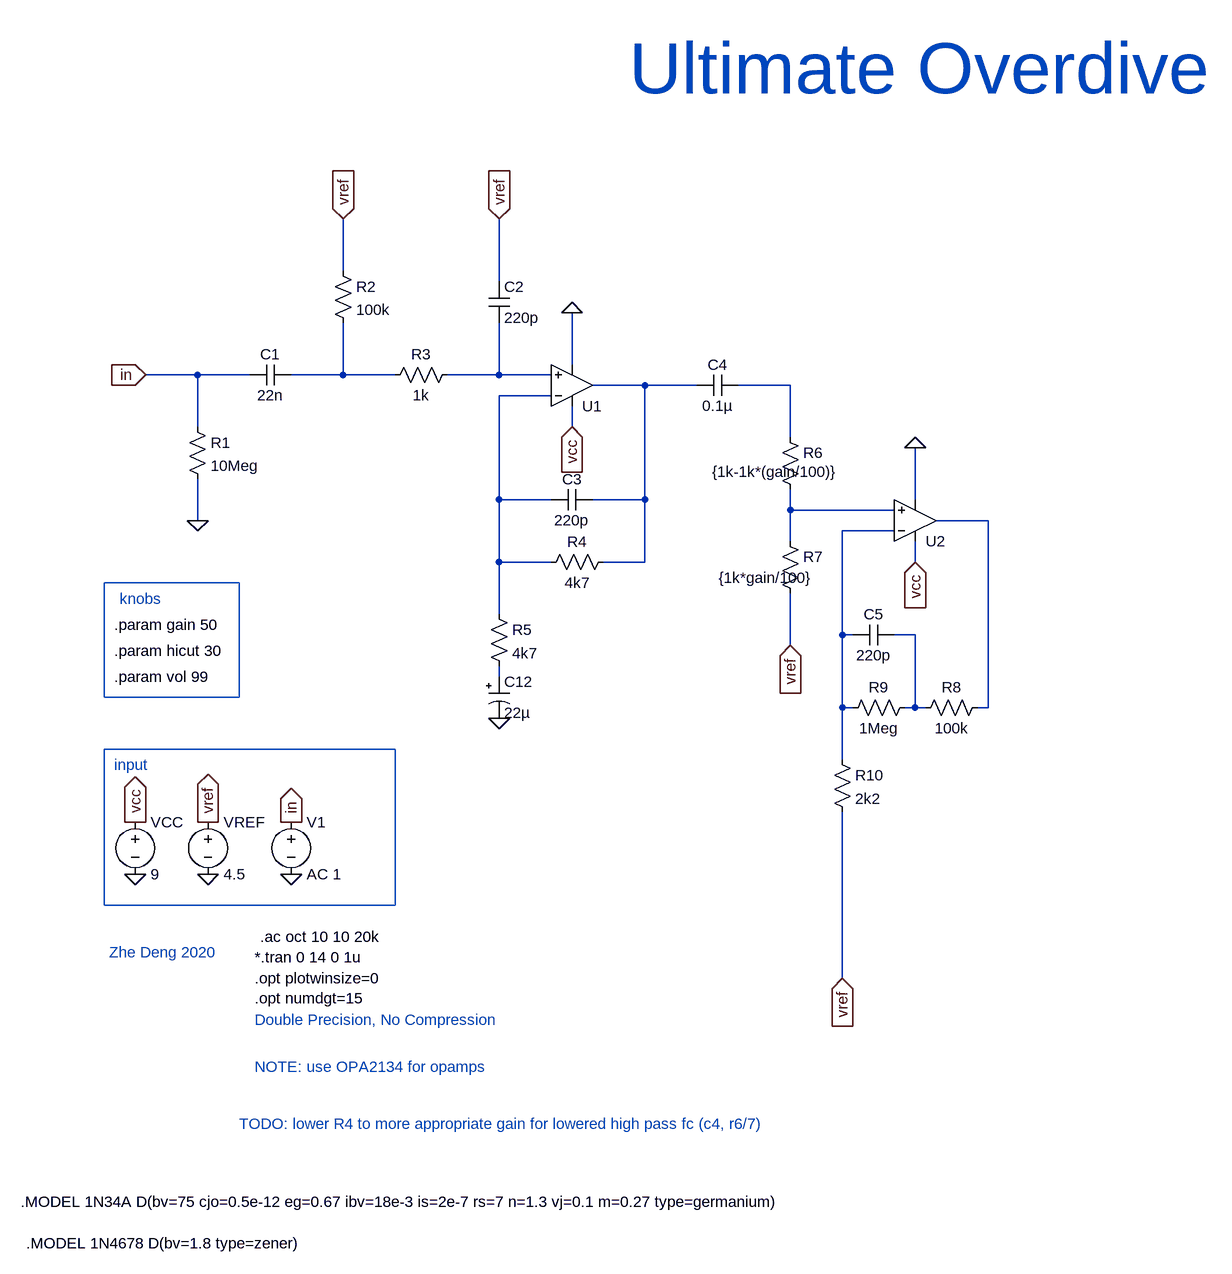
[diagram p0: schematic v2.asc]
v2.asc, the LTspice schematic file:
Version 4
SHEET 1 148324 120332
WIRE 145088 115648 145088 115568
WIRE 145328 115664 145328 115568
WIRE 145440 115792 145440 115712
WIRE 144864 115808 144784 115808
WIRE 144944 115808 144864 115808
WIRE 145088 115808 145088 115728
WIRE 145088 115808 145008 115808
WIRE 145168 115808 145088 115808
WIRE 145328 115808 145328 115728
WIRE 145328 115808 145248 115808
WIRE 145408 115808 145328 115808
WIRE 145552 115824 145472 115824
WIRE 145632 115824 145552 115824
WIRE 145776 115824 145696 115824
WIRE 145408 115840 145328 115840
WIRE 144864 115888 144864 115808
WIRE 145440 115888 145440 115856
WIRE 145776 115904 145776 115824
WIRE 145328 116000 145328 115840
WIRE 145408 116000 145328 116000
WIRE 145552 116000 145552 115824
WIRE 145552 116000 145472 116000
WIRE 145968 116000 145968 115920
WIRE 145776 116016 145776 115984
WIRE 145936 116016 145776 116016
WIRE 144864 116032 144864 115968
WIRE 146080 116032 146000 116032
WIRE 145936 116048 145856 116048
WIRE 145776 116064 145776 116016
WIRE 145328 116096 145328 116000
WIRE 145408 116096 145328 116096
WIRE 145552 116096 145552 116000
WIRE 145552 116096 145488 116096
WIRE 145968 116096 145968 116064
WIRE 145328 116176 145328 116096
WIRE 145856 116208 145856 116048
WIRE 145872 116208 145856 116208
WIRE 145968 116208 145936 116208
WIRE 145776 116224 145776 116144
WIRE 145328 116272 145328 116256
WIRE 145856 116320 145856 116208
WIRE 145872 116320 145856 116320
WIRE 145968 116320 145968 116208
WIRE 145968 116320 145952 116320
WIRE 145984 116320 145968 116320
WIRE 146080 116320 146080 116032
WIRE 146080 116320 146064 116320
WIRE 145856 116400 145856 116320
WIRE 145856 116736 145856 116480
FLAG 144768 116576 0
FLAG 144880 116576 0
FLAG 144880 116496 vref
IOPIN 144880 116496 Out
FLAG 144768 116496 vcc
IOPIN 144768 116496 Out
FLAG 145008 116496 in
IOPIN 145008 116496 Out
FLAG 145008 116576 0
FLAG 145088 115568 vref
IOPIN 145088 115568 In
FLAG 144784 115808 in
IOPIN 144784 115808 In
FLAG 145328 115568 vref
IOPIN 145328 115568 In
FLAG 145328 116336 0
FLAG 145968 115920 0
FLAG 145968 116096 vcc
IOPIN 145968 116096 In
FLAG 145440 115712 0
FLAG 145440 115888 vcc
IOPIN 145440 115888 In
FLAG 145856 116736 vref
IOPIN 145856 116736 In
FLAG 144864 116032 0
FLAG 145776 116224 vref
IOPIN 145776 116224 In
SYMBOL voltage 144768 116480 R0
WINDOW 123 0 0 Left 0
WINDOW 39 0 0 Left 0
SYMATTR InstName VCC
SYMATTR Value 9
SYMBOL voltage 144880 116480 R0
WINDOW 123 0 0 Left 0
WINDOW 39 0 0 Left 0
SYMATTR InstName VREF
SYMATTR Value 4.5
SYMBOL res 144848 115872 R0
SYMATTR InstName R1
SYMATTR Value 10Meg
SYMBOL cap 145008 115792 R90
WINDOW 0 0 32 VBottom 2
WINDOW 3 32 32 VTop 2
SYMATTR InstName C1
SYMATTR Value 22n
SYMBOL res 145072 115632 R0
SYMATTR InstName R2
SYMATTR Value 100k
SYMBOL res 145264 115792 R90
WINDOW 0 0 56 VBottom 2
WINDOW 3 32 56 VTop 2
SYMATTR InstName R3
SYMATTR Value 1k
SYMBOL cap 145312 115664 R0
SYMATTR InstName C2
SYMATTR Value 220p
SYMBOL cap 145472 115984 R90
WINDOW 0 0 32 VBottom 2
WINDOW 3 32 32 VTop 2
SYMATTR InstName C3
SYMATTR Value 220p
SYMBOL res 145504 116080 R90
WINDOW 0 0 56 VBottom 2
WINDOW 3 32 56 VTop 2
SYMATTR InstName R4
SYMATTR Value 4k7
SYMBOL res 145312 116160 R0
SYMATTR InstName R5
SYMATTR Value 4k7
SYMBOL cap 145696 115808 R90
WINDOW 0 0 32 VBottom 2
WINDOW 3 32 32 VTop 2
SYMATTR InstName C4
SYMATTR Value 0.1µ
SYMBOL res 145760 115888 R0
WINDOW 3 -104 69 Left 2
SYMATTR Value {1k-1k*(gain/100)}
SYMATTR InstName R6
SYMBOL res 145760 116048 R0
WINDOW 3 -94 72 Left 2
SYMATTR Value {1k*gain/100}
SYMATTR InstName R7
SYMBOL cap 145936 116192 R90
WINDOW 0 0 32 VBottom 2
WINDOW 3 32 32 VTop 2
SYMATTR InstName C5
SYMATTR Value 220p
SYMBOL res 146080 116304 R90
WINDOW 0 0 56 VBottom 2
WINDOW 3 32 56 VTop 2
SYMATTR InstName R8
SYMATTR Value 100k
SYMBOL res 145968 116304 R90
WINDOW 0 0 56 VBottom 2
WINDOW 3 32 56 VTop 2
SYMATTR InstName R9
SYMATTR Value 1Meg
SYMBOL res 145840 116384 R0
SYMATTR InstName R10
SYMATTR Value 2k2
SYMBOL polcap 145312 116272 R0
SYMATTR InstName C12
SYMATTR Value 22µ
SYMBOL Opamps\\UniversalOpamp2 145440 115824 M180
SYMATTR InstName U1
SYMBOL Opamps\\UniversalOpamp2 145968 116032 M180
SYMATTR InstName U2
SYMBOL voltage 145008 116480 R0
SYMATTR InstName V1
SYMATTR Value AC 1
TEXT 144736 116192 Left 2 !.param gain 50
TEXT 144736 116232 Left 2 !.param hicut 30
TEXT 144736 116272 Left 2 !.param vol 99
TEXT 144744 116152 Left 2 ;knobs
TEXT 144736 116408 Left 2 ;input
TEXT 144728 116696 Left 2 ;Zhe Deng 2020
TEXT 145528 115336 Left 7 ;Ultimate Overdive
TEXT 144952 116704 Left 2 !*.tran 0 14 0 1u
TEXT 144952 116736 Left 2 !.opt plotwinsize=0\n.opt numdgt=15
TEXT 144952 116800 Left 2 ;Double Precision, No Compression
TEXT 144960 116672 Left 2 !.ac oct 10 10 20k
TEXT 144952 116872 Left 2 ;NOTE: use OPA2134 for opamps
TEXT 144592 117080 Left 2 !.MODEL 1N34A D(bv=75 cjo=0.5e-12 eg=0.67 ibv=18e-3 is=2e-7 rs=7 n=1.3 vj=0.1 m=0.27 type=germanium)
TEXT 144600 117144 Left 2 !.MODEL 1N4678 D(bv=1.8 type=zener)
TEXT 144928 116960 Left 2 ;TODO: lower R4 to more appropriate gain for lowered high pass fc (c4, r6/7)
RECTANGLE Normal 144928 116304 144720 116128
RECTANGLE Normal 145168 116624 144720 116384

The netlist it stands for:
* v2.asc
VCC vcc 0 9
VREF vref 0 4.5
R1 in 0 10Meg
C1 N001 in 22n
R2 vref N001 100k
R3 N002 N001 1k
C2 vref N002 220p
C3 N003 N005 220p
R4 N003 N005 4k7
R5 N005 N010 4k7
C4 N004 N003 0.1µ
R6 N004 N006 {1k-1k*(gain/100)}
R7 N006 vref {1k*gain/100}
C5 N009 N008 220p
R8 N007 N009 100k
R9 N009 N008 1Meg
R10 N008 vref 2k2
C12 N010 0 22µ
XU1 N002 N005 vcc 0 N003 level.2 Avol=1Meg GBW=10Meg Slew=10Meg ilimit=25m rail=0 Vos=0 phimargin=45 en=0 enk=0 in=0 ink=0 Rin=500Meg  ; pins IN+ IN- V+ V- OUT
XU2 N006 N008 vcc 0 N007 level.2 Avol=1Meg GBW=10Meg Slew=10Meg ilimit=25m rail=0 Vos=0 phimargin=45 en=0 enk=0 in=0 ink=0 Rin=500Meg  ; pins IN+ IN- V+ V- OUT
V1 in 0 AC 1
.param gain 50
.param hicut 30
.param vol 99
* knobs
* input
* Zhe Deng 2020
* Ultimate Overdive
*.tran 0 14 0 1u
.opt plotwinsize=0
.opt numdgt=15
* Double Precision, No Compression
.ac oct 10 10 20k
* NOTE: use OPA2134 for opamps
.MODEL 1N34A D(bv=75 cjo=0.5e-12 eg=0.67 ibv=18e-3 is=2e-7 rs=7 n=1.3 vj=0.1 m=0.27 type=germanium)
.MODEL 1N4678 D(bv=1.8 type=zener)
* TODO: lower R4 to more appropriate gain for lowered high pass fc (c4, r6/7)
.lib UniversalOpamps2.sub
.backanno
.end